# EAGLE schematic POWER_120V_V-1 (EAGLE 9.5.1)
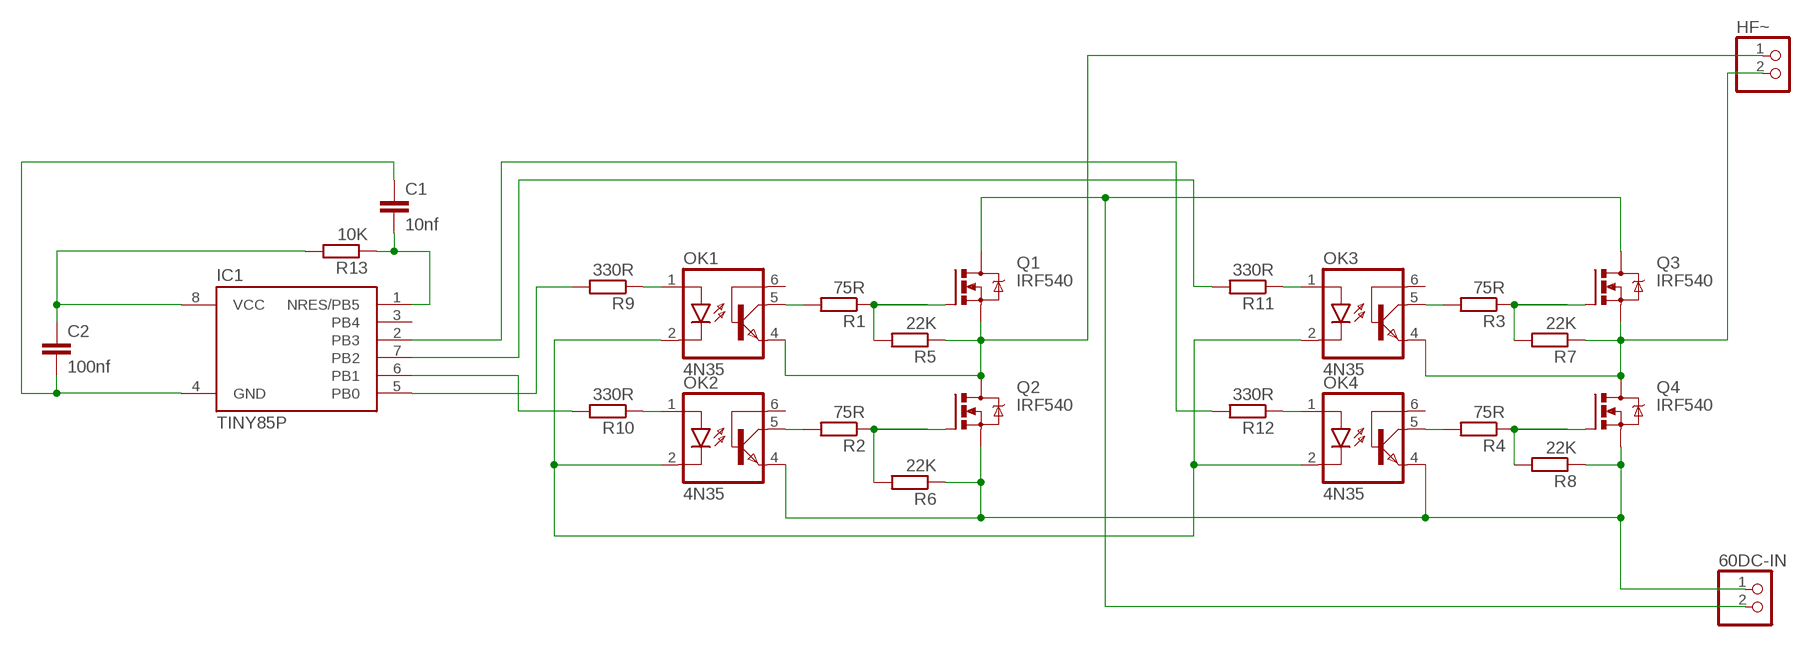
[diagram p0: schematic, sheet 1]

## Parts
60DC-IN  PINHD-1X2  [1X02]
C1  10nf  C-EU050-025X075  [C050-025X075]
C2  100nf  C-EU050-025X075  [C050-025X075]
HF~  PINHD-1X2  [1X02]
IC1  TINY85P  [TINY85P]
OK1  4N35  [DIL06]
OK2  4N35  [DIL06]
OK3  4N35  [DIL06]
OK4  4N35  [DIL06]
Q1  IRF540  [TO220BV]
Q2  IRF540  [TO220BV]
Q3  IRF540  [TO220BV]
Q4  IRF540  [TO220BV]
R1  75R  RESISTOR_1/4  [RESISTOR_1/4_7.5]
R2  75R  RESISTOR_1/4  [RESISTOR_1/4_7.5]
R3  75R  RESISTOR_1/4  [RESISTOR_1/4_7.5]
R4  75R  RESISTOR_1/4  [RESISTOR_1/4_7.5]
R5  22K  RESISTOR_1/4  [RESISTOR_1/4_7.5]
R6  22K  RESISTOR_1/4  [RESISTOR_1/4_7.5]
R7  22K  RESISTOR_1/4  [RESISTOR_1/4_7.5]
R8  22K  RESISTOR_1/4  [RESISTOR_1/4_7.5]
R9  330R  RESISTOR_1/4  [RESISTOR_1/4_7.5]
R10  330R  RESISTOR_1/4  [RESISTOR_1/4_7.5]
R11  330R  RESISTOR_1/4  [RESISTOR_1/4_7.5]
R12  330R  RESISTOR_1/4  [RESISTOR_1/4_7.5]
R13  10K  RESISTOR_1/4  [RESISTOR_1/4_7.5]

## Nets
N$1: 60DC-IN.1 OK2.4(EMI) OK4.4(EMI) Q2.S Q4.S R6.1 R8.1
N$2: 60DC-IN.2 Q1.D Q3.D
N$3: HF~.1 OK1.4(EMI) Q1.S Q2.D R5.1
N$4: HF~.2 OK3.4(EMI) Q3.S Q4.D R7.1
N$5: Q2.G R2.1 R6.2
N$6: Q1.G R1.1 R5.2
N$7: Q3.G R3.1 R7.2
N$8: Q4.G R4.1 R8.2
N$9: OK2.5(COL) R2.2
N$10: OK4.5(COL) R4.2
N$11: OK1.5(COL) R1.2
N$12: OK3.5(COL) R3.2
N$13: OK1.1(A) R9.1
N$14: OK2.1(A) R10.1
N$15: OK3.1(A) R11.1
N$16: OK4.1(A) R12.1
N$17: OK1.2(C) OK2.2(C) OK3.2(C) OK4.2(C)
N$18: IC1.5(PB0) R9.2
N$19: IC1.6(PB1) R10.2
N$20: IC1.7(PB2) R11.2
N$21: IC1.2(PB3) R12.2
N$22: C1.2 IC1.1(NRES/PB5) R13.1
N$23: C1.1 C2.2 IC1.4(GND)
N$24: C2.1 IC1.8(VCC) R13.2
Unconnected: IC1.3(PB4) OK1.6(BAS) OK2.6(BAS) OK3.6(BAS) OK4.6(BAS)

## Library data of the parts
60DC-IN HF~ = pinhead:PINHD-1X2: PIN HEADER
C1 C2 = 00-tecnicosotv:C-EU: CAPACITOR, European symbol
IC1 = 00-tecnicosotv:TINY85P: Atmel MCU
OK1-OK4 = optocoupler:4N35: MOTOROLA OPTO COUPLER; MF: FAIRCHILD SEMICONDUCTOR; MPN: 4N35; OC_FARNELL: 1328375; OC_NEWARK: 72K9946
Q1-Q4 = transistor-power:IRF540: HEXFET Power MOSFET
R1-R13 = 00-tecnicosotv:RESISTOR_1/4